# EAGLE design squall-blees-board (EAGLE 7.2.0)
AUTHOR: BLEES Dev Team; REV: A; TITLE: BLEES Sensor Board
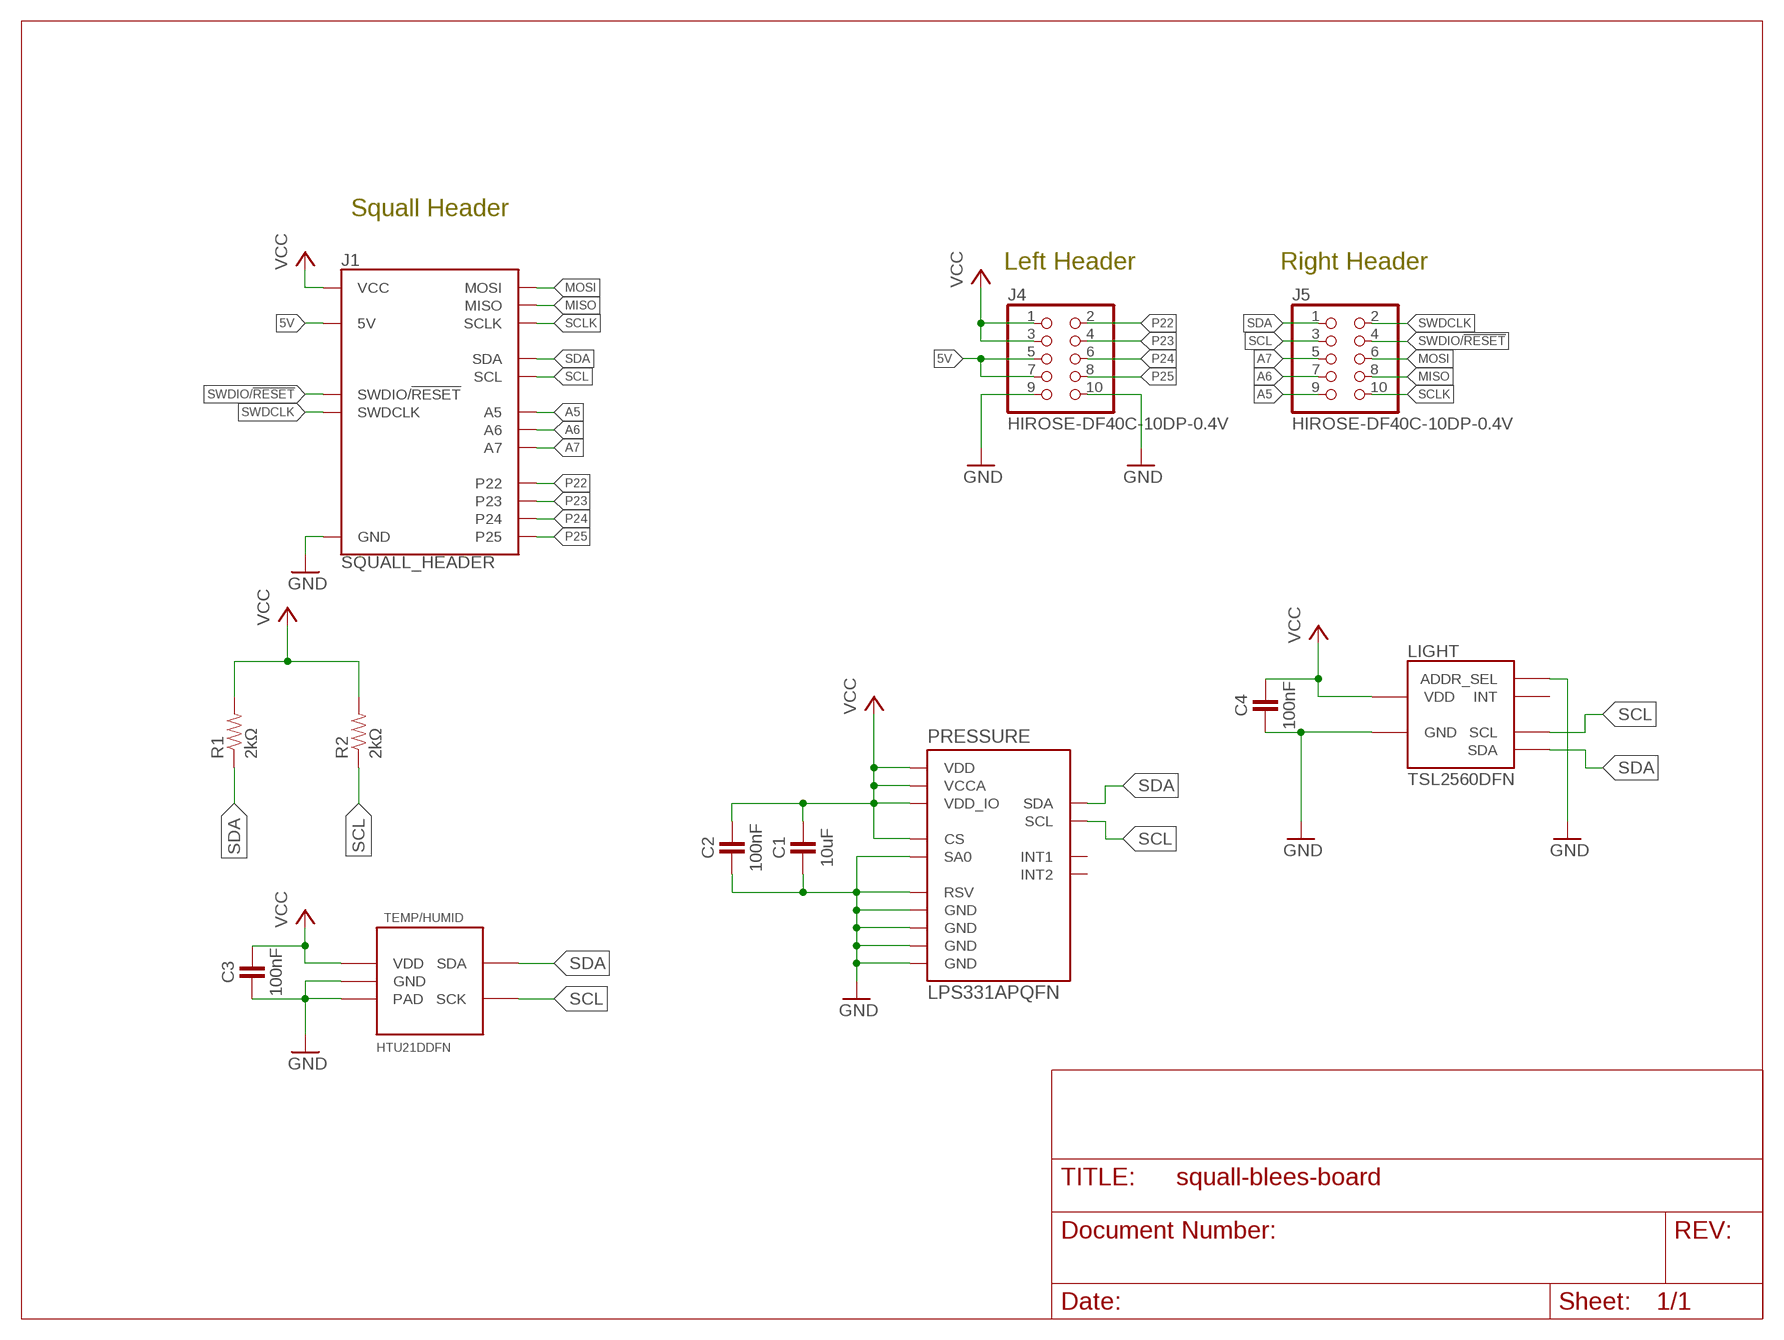
[diagram p0: schematic, sheet 1]

## Parts
C1  10uF  CAPACITOR0603_CAP  [0603_CAP]
C2  100nF  CAPACITOR  [0402_CAP]
C3  100nF  CAPACITOR  [0402_CAP]
C4  100nF  CAPACITOR  [0402_CAP]
J1  SQUALL_HEADER  [SQUALL_HEADER]
J4  HIROSE-DF40C-10DP-0.4V  [2X5/SMD/0.4MM]
J5  HIROSE-DF40C-10DP-0.4V  [2X5/SMD/0.4MM]
LIGHT  TSL2560DFN  [DFN2]
PRESSURE  LPS331APQFN  [HCLGA-16L]
R1  2kΩ  RESISTOR0402_RES  [0402_RES]
R2  2kΩ  RESISTOR0402_RES  [0402_RES]
TEMP/HUMID  HTU21DDFN  [DFN]

## Nets
5V: J1.A5(5V) J1.A7(5V) J4.5 J4.7
A5: J1.B9(A5) J5.9
A6: J1.B7(A6) J5.7
A7: J1.B5(A7) J5.5
GND: C1.2 C2.2 C3.2 C4.2 J1.A9(GND) J1.A10(GND) J4.9 J4.10 LIGHT.2(ADDR_SEL) LIGHT.3(GND) PRESSURE.5(GND) PRESSURE.7(SA0) PRESSURE.10(RSV) PRESSURE.12(GND) PRESSURE.13(GND) PRESSURE.16(GND) TEMP/HUMID.2(GND) TEMP/HUMID.PAD
MISO: J1.B8(MISO) J5.8
MOSI: J1.B6(MOSI) J5.6
P22: J1.A2(P22) J4.2
P23: J1.A4(P23) J4.4
P24: J1.A6(P24) J4.6
P25: J1.A8(P25) J4.8
SCL: J1.B3(SCL) J5.3 LIGHT.4(SCL) PRESSURE.4(SCL) R2.1 TEMP/HUMID.6(SCK)
SCLK: J1.B10(SCLK) J5.10
SDA: J1.B1(SDA) J5.1 LIGHT.6(SDA) PRESSURE.6(SDA) R1.1 TEMP/HUMID.1(SDA)
SWDCLK: J1.B2(SWDCLK) J5.2
SWDIO/!RESET: J1.B4(SWDIO/!RESET) J5.4
VCC: C1.1 C2.1 C3.1 C4.1 J1.A1(VCC) J1.A3(VCC) J4.1 J4.3 LIGHT.1(VDD) PRESSURE.1(VDD_IO) PRESSURE.8(CS) PRESSURE.14(VDD) PRESSURE.15(VCCA) R1.2 R2.2 TEMP/HUMID.5(VDD)
Unconnected: LIGHT.5(INT) PRESSURE.9(INT2) PRESSURE.11(INT1)

## Notes on the sheet
- Squall Header
- Left Header | Right Header

## Library data of the parts
C1-C4 = passives:CAPACITOR: 0402 Capacitor
J1 = squall:SQUALL_HEADER: Header for a sensor board on top of the Squall BLE tag board. Requires two DF40C-10DS-0.4V(51).; DIGIKEY: H11617CT-ND
J4 J5 = headers:HIROSE-DF40C-10DP-0.4V: DF40 Series Header - 0.4MM Pitch; DIGIKEY: H11616CT-ND; MOUSER: 798-DF40C10DP0.4V51; NEWARK: 68X2585
LIGHT = blees:TSL2560: TSL2560 light to digital converter, written by BLEES EECS 373.
PRESSURE = blees:LPS331AP: LPS331AP pressure sensor device designed by BLEES EECS 373
R1 R2 = passives:RESISTOR: Resistor Basic schematic elements and footprints for 0603, 1206, and PTH resistors.
TEMP/HUMID = blees:HTU21D: This is the HTU21D Temp/Humidity sensor made by BLEES EECS 373.

## Board
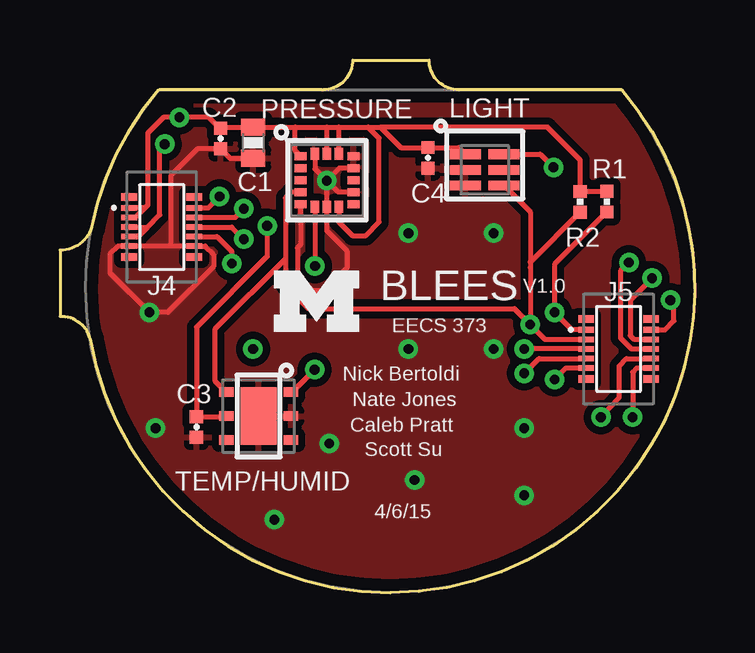
[diagram p1: board, top side]
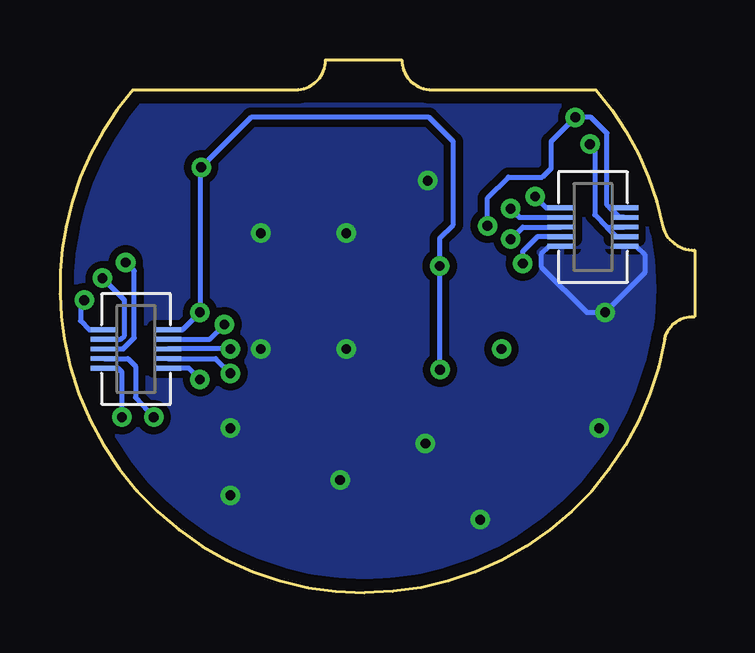
[diagram p2: board, bottom side, seen from below]

Size 26.46 x 22.2 mm. Coordinates in mm from the lower left corner, seen from the top.
Outline: 10.96,20.95 arc90 12.2,22.2 15.39,22.2 arc90 16.64,20.95 23.42,20.95 arc-30 26.21,15.25 arc-21 26.28,10.58 arc-80 13.77,0 arc-80 1.25,10.58 arc80 0,11.51 0,14.28 arc75 1.33,15.25 arc-30 4.11,20.95
Outline: 10.92,20.95 4.14,20.95
Copper layers (1*16): Top 0.0178mm / dielectric 59mil / Bottom 0.0178mm
Design rules "sunstone-2lyr_v1.0.0.3 *": minimum track width 6mil, minimum drill 14mil, track to track 5mil, track to pad 5mil, pad to pad 5mil, via to via 5mil, smd to smd 5mil, copper to edge 20mil, drill to drill 16mil, minimum pad ring 8mil, minimum via ring 8mil, stop-mask expansion 3mil, vias tented up to drill 0mil, thermal gap 10mil
tRestrict: 3 lines
bRestrict: 2 lines

### Footprints (pad centres in the part's own frame; a part is rotated, then mirrored left to right if it is on the bottom)
0603_CAP = smd 0.7 x 1: 1 -0.65,0; 2 0.65,0
0402_CAP = smd 0.536 x 0.546: 1 -0.433,0; 2 0.433,0
SQUALL_HEADER = smd 1.14 x 0.2 bottom: A1 -10.845,3.34; A2 -8.205,3.34; A3 -10.845,2.94; A4 -8.205,2.94; A5 -10.845,2.54; A6 -8.205,2.54; A7 -10.845,2.14; A8 -8.205,2.14; A9 -10.845,1.74; A10 -8.205,1.74; B1 8.205,-1.74; B2 10.845,-1.74; B3 8.205,-2.14; B4 10.845,-2.14; B5 8.205,-2.54; B6 10.845,-2.54; B7 8.205,-2.94; B8 10.845,-2.94; B9 8.205,-3.34; B10 10.845,-3.34
2X5/SMD/0.4MM = smd 0.66 x 0.23: 1 -1.355,0.8; 2 1.355,0.8; 3 -1.355,0.4; 4 1.355,0.4; 5 -1.355,0; 6 1.355,0; 7 -1.355,-0.4; 8 1.355,-0.4; 9 -1.355,-0.8; 10 1.355,-0.8 | smd 0.66 x 0.3: A -1.355,1.25; B 1.355,1.25; C -1.355,-1.25; D 1.355,-1.25
DFN2 = smd 1.3 x 0.4: 1 -0.8,0.65; 2 -0.8,0; 3 -0.8,-0.65; 4 0.8,-0.65; 5 0.8,0; 6 0.8,0.65
HCLGA-16L = smd 0.5 x 0.35: 1 -1.1,1; 2 -1.1,0.5; 3 -1.1,0; 4 -1.1,-0.5; 5 -1.1,-1; 9 1.1,-1; 10 1.1,-0.5; 11 1.1,0; 12 1.1,0.5; 13 1.1,1 | smd 0.35 x 0.5: 6 -0.5,-1.1; 7 0,-1.1; 8 0.5,-1.1; 14 0.5,1.1; 15 0,1.1; 16 -0.5,1.1
0402_RES = smd 0.536 x 0.546: 1 -0.433,0; 2 0.433,0
DFN = smd 0.6 x 0.4: 1 -1.35,-1; 2 -1.35,0; 3 -1.35,1; 4 1.35,1; 5 1.35,0; 6 1.35,-1 | smd 1.5 x 2.4: PAD 0,0

### Placement (x,y rotation side)
C1  8.06,18.75 270 top
C2  6.71,18.93 270 top
C3  5.69,6.91 270 top
C4  15.34,18.12 270 top
J1  13.77,12.7 0 top
J4  4.24,15.24 0 top
J5  23.29,10.16 0 top
LIGHT  17.71,17.62 0 top
PRESSURE  11.13,17.19 0 top
R1  22.81,16.3 90 top
R2  21.69,16.29 90 top
TEMP/HUMID  8.28,7.37 180 top

### Tracks (layer width: path | path; a pad name or v marks a point on that pad's centre or on a via)
5V  (via drill 0.41)
  Top 0.203: J4.5 3.66,15.24 | 3.66,15.24 4.17,15.75 4.17,18.49 v4.37,18.69 | J4.7 3.26,14.84 3.66,15.24
  Bottom 0.203: v4.37,18.69 4.17,18.49 4.17,15.75 3.66,15.24 | 3.66,15.24 J1.A5 | J1.A7 3.26,14.84 3.66,15.24
A5  (via drill 0.41)
  Top 0.203: J5.9 21.09,9.36 v20.62,8.89
  Bottom 0.203: v20.62,8.89 21.09,9.36 J1.B9
A6  (via drill 0.41)
  Top 0.203: v19.35,9.14 19.97,9.76 J5.7
  Bottom 0.203: J1.B7 19.97,9.76 v19.35,9.14
A7  (via drill 0.41)
  Top 0.203: J5.5 v19.35,10.16
  Bottom 0.203: v19.35,10.16 J1.B5
GND  (via drill 0.41)
  Top 0.203: 4.62,14.44 J4.10 6.06,14.44 6.4,14.1 6.4,13.59 4.5,11.68 v3.73,11.68 2.08,13.34 2.08,14.1 2.43,14.44 J4.9 4.62,14.44 | 4.62,14.44 4.62,17.37 5.74,18.5 C2.2 7.1,18.1 C1.2 | PRESSURE.5 10.03,14.5 9.91,14.38 9.91,13.21 10.52,12.6 11.02,12.6 11.99,13.56 11.99,14.22 11.13,15.08 PRESSURE.7 v11.13,17.17 v11.12,17.17 | PRESSURE.12 11.65,17.69 v11.12,17.17 | PRESSURE.16 10.63,17.66 v11.12,17.17 | PRESSURE.10 11.6,16.69 v11.12,17.17
  Bottom 0.203: J1.A9 2.43,14.44 2.08,14.1 2.08,13.34 v3.73,11.68 4.5,11.68 6.4,13.59 6.4,14.1 6.06,14.44 J1.A10
  other vias: 14.53,14.99 18.08,14.99 14.53,10.16 18.08,10.16 19.35,6.86 11.23,6.22 14.78,4.7 19.35,4.06 8.94,3.05 3.99,6.86
  pour Top (isolate 0.305): 26.47,12.7 arc-180 1.07,12.7 arc-41 4.11,20.95 23.42,20.95 arc-41
  pour Bottom (isolate 0.305): 26.47,12.7 arc-180 1.07,12.7 arc-41 4.11,20.95 23.42,20.95 arc-41
MISO  (via drill 0.41)
  Top 0.203: v22.55,7.32 23.32,8.13 23.32,9.45 23.62,9.75 J5.8
  Bottom 0.203: J1.B8 23.63,9.76 23.32,9.45 23.32,8.13 v22.55,7.32
MOSI  (via drill 0.41)
  Top 0.203: v23.72,13.77 23.37,13.41 23.37,10.62 23.82,10.16 J5.6
  Bottom 0.203: J1.B6 23.82,10.16 23.37,10.62 23.37,13.41 v23.72,13.77
N$5  (via drill 0.41)
  other vias: 8.05,10.16
P22  (via drill 0.41)
  Top 0.203: J4.2 6.18,16.04 v6.65,16.51
  Bottom 0.203: v6.65,16.51 6.18,16.04 J1.A2
P23  (via drill 0.41)
  Top 0.203: J4.4 7.31,15.64 v7.67,16
  Bottom 0.203: v7.67,16 7.31,15.64 J1.A4
P24  (via drill 0.41)
  Top 0.203: J4.6 7.16,15.24 v7.67,14.73
  Bottom 0.203: v7.67,14.73 7.16,15.24 J1.A6
P25  (via drill 0.41)
  Top 0.203: J4.8 6.55,14.84 7.16,14.22 v7.16,13.72
  Bottom 0.203: J1.A8 6.55,14.84 7.16,14.22 v7.16,13.72
SCL  (via drill 0.41)
  Top 0.203: v19.61,11.18 20.22,10.56 J5.3 | LIGHT.4 19.61,15.87 19.61,13.78 | v19.61,11.18 19.61,13.56 19.61,13.78 | 9.4,13.92 9.4,16.46 9.63,16.69 PRESSURE.4 | 9.4,13.92 6.45,10.97 6.45,8.85 TEMP/HUMID.6 | 9.4,13.92 9.4,12.8 10.36,11.84 18.95,11.84 v19.61,11.18 | R2.1 19.61,13.78
  Bottom 0.203: J1.B3 20.22,10.56 v19.61,11.18
SCLK  (via drill 0.41)
  Top 0.203: J5.10 24.04,9.36 23.88,9.2 v23.88,7.32
  Bottom 0.203: v23.88,7.32 23.88,9.2 24.04,9.36 J1.B10
SDA  (via drill 0.41)
  Top 0.203: J5.1 21.35,10.96 v20.62,11.68 20.62,13.68 R1.1 | v20.57,17.73 20.03,18.27 LIGHT.6 18.59,18.19 | v10.62,9.3 9.69,8.37 TEMP/HUMID.1 | PRESSURE.6 v10.63,13.61
  Bottom 0.203: J1.B1 21.35,10.96 v20.62,11.68 20.62,17.68 v20.57,17.73 18.49,19.81 11.07,19.81 10.06,18.8 10.06,15.34 10.63,14.77 v10.63,13.61 10.63,13.51 10.63,9.31 v10.62,9.3
SWDCLK  (via drill 0.41)
  Top 0.203: J5.2 25.23,10.96 25.6,11.33 25.6,12.04 v25.45,12.19
  Bottom 0.203: v25.45,12.19 25.6,12.04 25.6,11.33 25.23,10.96 J1.B2
SWDIO/!RESET  (via drill 0.41)
  Top 0.203: v24.69,13.11 23.77,12.19 23.77,10.72 23.93,10.57 J5.4
  Bottom 0.203: J1.B4 23.93,10.56 23.77,10.72 23.77,12.19 v24.69,13.11
VCC  (via drill 0.41)
  Top 0.203: 9.8,19.4 C1.1 6.74,19.4 C2.1 6.65,19.36 6.2,19.81 v4.98,19.81 4.32,19.81 3.66,19.15 3.66,16.15 3.54,16.04 | 9.8,19.4 11.13,19.4 | 11.13,19.4 11.63,19.4 | 11.63,19.4 12.85,19.4 | 12.85,19.4 13.37,19.4 | 13.37,19.4 14.21,18.55 C4.1 16.63,18.55 LIGHT.1 | PRESSURE.1 9.8,18.42 9.8,19.4 | PRESSURE.15 11.13,19.4 | PRESSURE.14 11.63,19.4 | 3.54,16.04 J4.1 | J4.3 3.14,15.64 3.54,16.04 | 13.37,19.4 20.33,19.4 21.69,18.04 R2.2 21.7,16.73 R1.2 | PRESSURE.8 11.63,15.45 12.19,14.88 12.75,14.88 13.31,15.44 13.31,18.94 12.85,19.4 | TEMP/HUMID.5 6.91,7.34 C3.1 5.69,11.07 8.64,14.02 v8.64,15.29
  Bottom 0.203: J1.A1 3.54,16.04 | 3.54,16.04 3.66,16.15 3.66,19.15 4.32,19.81 v4.98,19.81 5.99,18.8 5.99,17.68 6.35,17.32 7.77,17.32 8.64,16.46 v8.64,15.29 | J1.A3 3.14,15.64 3.54,16.04

### Text on the board
tPlace: BLEES | V1.0 | EECS 373 | Nick Bertoldi | Nate Jones | Caleb Pratt | Scott Su | 4/6/15